# EAGLE design l-drv_h2 (EAGLE 6.5.0)
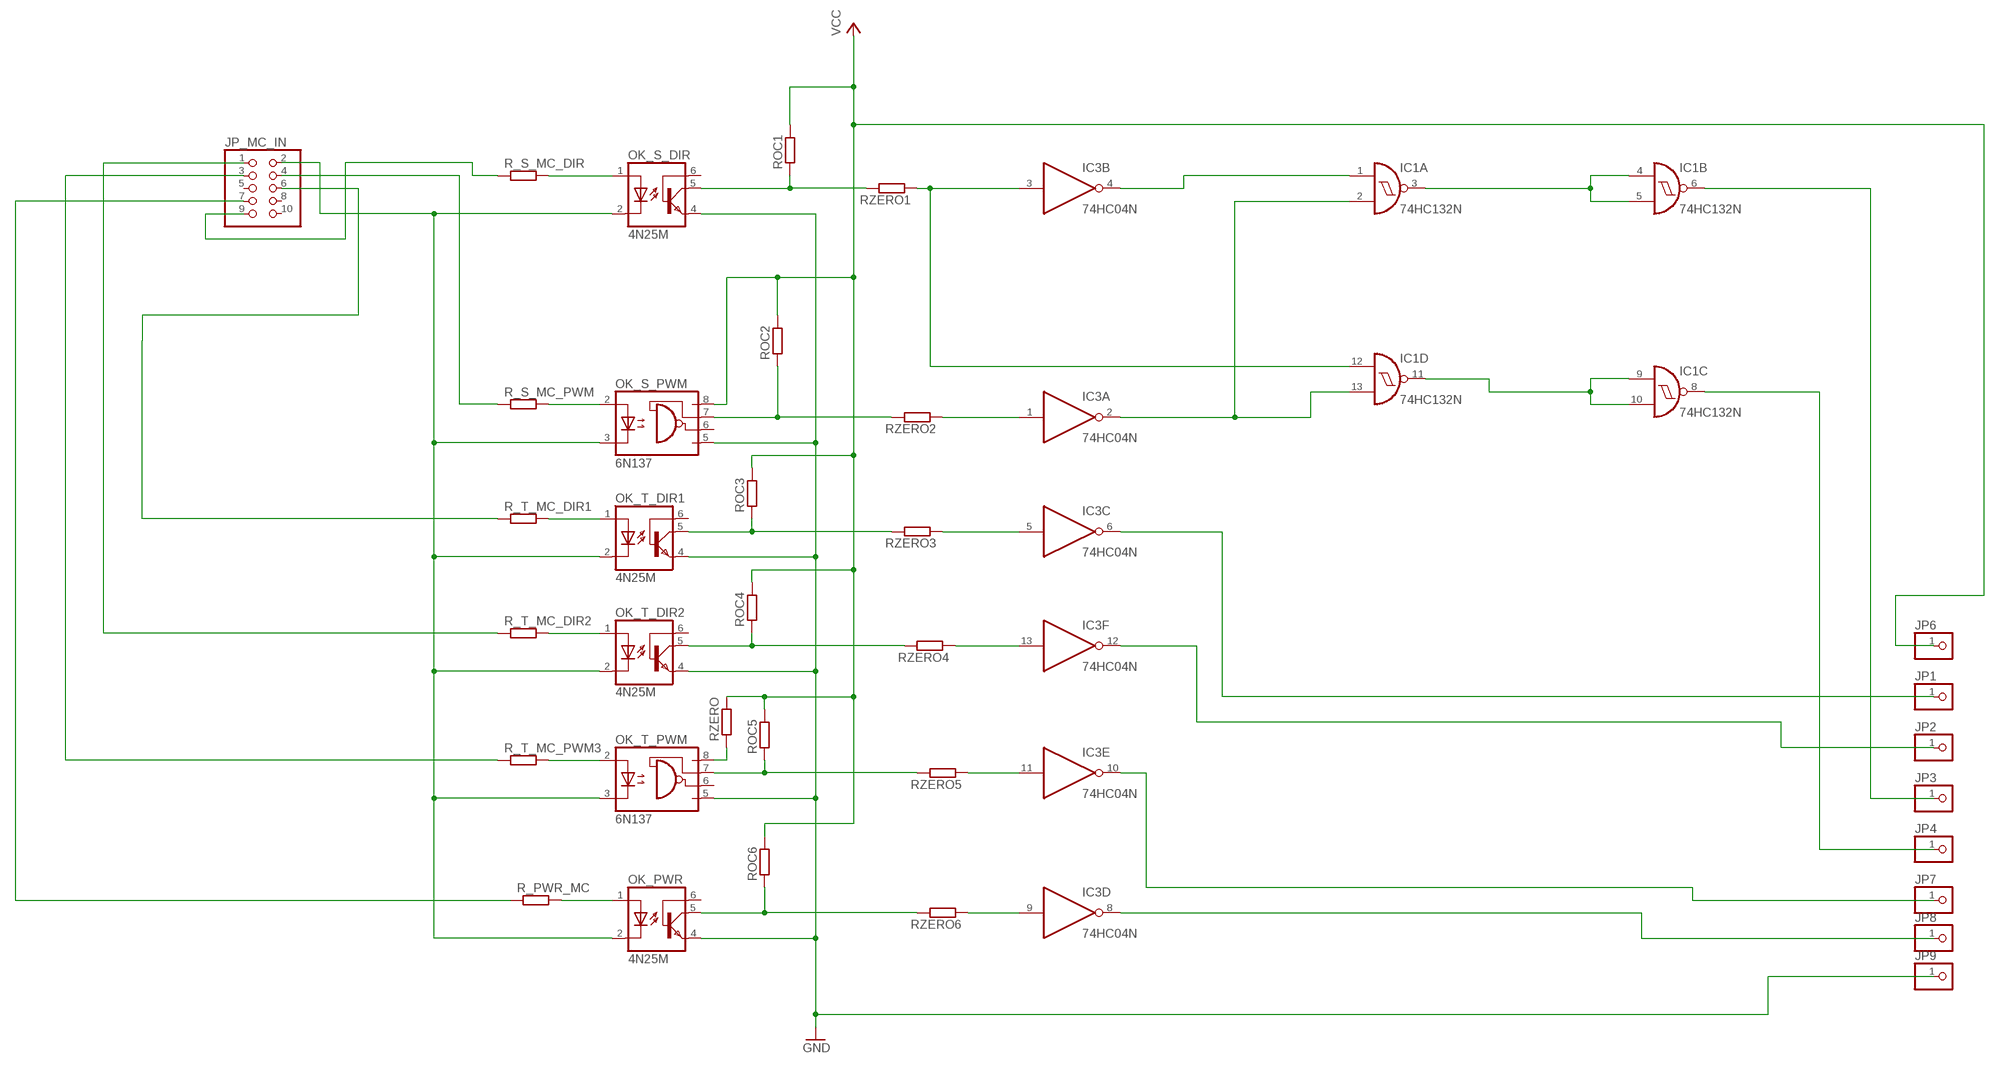
[diagram p0: schematic, sheet 1]

## Parts
IC1  74HC132N  [DIL14]
IC3  74HC04N  [DIL14]
JP1  PINHD-1X1  [1X01]
JP2  PINHD-1X1  [1X01]
JP3  PINHD-1X1  [1X01]
JP4  PINHD-1X1  [1X01]
JP6  PINHD-1X1  [1X01]
JP7  PINHD-1X1  [1X01]
JP8  PINHD-1X1  [1X01]
JP9  PINHD-1X1  [1X01]
JP_MC_IN  PINHD-2X5  [2X05]
OK_PWR  4N25M  [DIL06]
OK_S_DIR  4N25M  [DIL06]
OK_S_PWM  6N137  [DIL08]
OK_T_DIR1  4N25M  [DIL06]
OK_T_DIR2  4N25M  [DIL06]
OK_T_PWM  6N137  [DIL08]
R_PWR_MC  R-EU_0204/5  [0204/5]
R_S_MC_DIR  R-EU_0204/5  [0204/5]
R_S_MC_PWM  R-EU_0204/5  [0204/5]
R_T_MC_DIR1  R-EU_0204/5  [0204/5]
R_T_MC_DIR2  R-EU_0204/5  [0204/5]
R_T_MC_PWM3  R-EU_0204/5  [0204/5]
ROC1  R-EU_0204/5  [0204/5]
ROC2  R-EU_0204/5  [0204/5]
ROC3  R-EU_0204/5  [0204/5]
ROC4  R-EU_0204/5  [0204/5]
ROC5  R-EU_0204/5  [0204/5]
ROC6  R-EU_0204/5  [0204/5]
RZERO  R-EU_0204/5  [0204/5]
RZERO1  R-EU_0204/5  [0204/5]
RZERO2  R-EU_0204/5  [0204/5]
RZERO3  R-EU_0204/5  [0204/5]
RZERO4  R-EU_0204/5  [0204/5]
RZERO5  R-EU_0204/5  [0204/5]
RZERO6  R-EU_0204/5  [0204/5]

## Nets
GND: JP9.1 OK_PWR.4(EMI) OK_S_DIR.4(EMI) OK_S_PWM.5(GND) OK_T_DIR1.4(EMI) OK_T_DIR2.4(EMI) OK_T_PWM.5(GND)
MC_GND: JP_MC_IN.2 OK_PWR.2(C) OK_S_DIR.2(C) OK_S_PWM.3(C) OK_T_DIR1.2(C) OK_T_DIR2.2(C) OK_T_PWM.3(C)
N$1: OK_S_DIR.1(A) R_S_MC_DIR.2
N$2: OK_S_PWM.2(A) R_S_MC_PWM.2
N$3: OK_T_DIR1.1(A) R_T_MC_DIR1.2
N$4: OK_T_DIR2.1(A) R_T_MC_DIR2.2
N$5: OK_T_PWM.2(A) R_T_MC_PWM3.2
N$6: JP_MC_IN.9 R_S_MC_DIR.1
N$7: JP_MC_IN.4 R_S_MC_PWM.1
N$8: JP_MC_IN.6 R_T_MC_DIR1.1
N$9: JP_MC_IN.1 R_T_MC_DIR2.1
N$10: JP_MC_IN.3 R_T_MC_PWM3.1
N$11: OK_T_DIR1.5(COL) ROC3.1 RZERO3.2
N$12: IC1.12(D:I0) IC3.3(B:I) RZERO1.1
N$13: OK_T_PWM.7(VE) ROC5.1 RZERO5.2
N$14: OK_PWR.1(A) R_PWR_MC.2
N$15: OK_T_DIR2.5(COL) ROC4.1 RZERO4.2
N$16: JP_MC_IN.7 R_PWR_MC.1
N$17: OK_S_PWM.7(VE) ROC2.1 RZERO2.2
N$18: OK_S_DIR.5(COL) ROC1.1 RZERO1.2
N$19: OK_PWR.5(COL) ROC6.1 RZERO6.2
N$20: IC3.8(D:O) JP8.1
N$21: IC3.10(E:O) JP7.1
N$22: IC3.12(F:O) JP2.1
N$23: IC3.6(C:O) JP1.1
N$24: IC1.6(B:O) JP3.1
N$25: IC1.8(C:O) JP4.1
N$26: IC1.2(A:I1) IC1.13(D:I1) IC3.2(A:O)
N$27: IC1.1(A:I0) IC3.4(B:O)
N$28: IC1.3(A:O) IC1.4(B:I0) IC1.5(B:I1)
N$29: IC1.9(C:I0) IC1.10(C:I1) IC1.11(D:O)
N$30: IC3.1(A:I) RZERO2.1
N$31: IC3.5(C:I) RZERO3.1
N$32: IC3.13(F:I) RZERO4.1
N$33: IC3.11(E:I) RZERO5.1
N$34: IC3.9(D:I) RZERO6.1
N$35: OK_T_PWM.8(VCC) RZERO.1
VCC: JP6.1 OK_S_PWM.8(VCC) ROC1.2 ROC2.2 ROC3.2 ROC4.2 ROC5.2 ROC6.2 RZERO.2
Unconnected: JP_MC_IN.5 JP_MC_IN.8 JP_MC_IN.10 OK_PWR.6(BAS) OK_S_DIR.6(BAS) OK_S_PWM.6(VO) OK_T_DIR1.6(BAS) OK_T_DIR2.6(BAS) OK_T_PWM.6(VO)

## Power pins joined to a net without a drawn wire
GND: IC1.7(P:GND) IC3.7(P:GND)
VCC: IC1.14(P:VCC) IC3.14(P:VCC)

## Library data of the parts
IC1 = 74xx-eu:74*132: Quad 2-input NAND schmitt trigger
IC3 = 74xx-eu:74*04: Hex INVERTER
JP1-JP4 JP6-JP9 = pinhead:PINHD-1X1: PIN HEADER
JP_MC_IN = pinhead:PINHD-2X5: PIN HEADER
OK_PWR OK_S_DIR OK_T_DIR1 OK_T_DIR2 = optocoupler:4N*?M: General Purpose 6-Pin Phototransistor Optocouplers Source: http://www.fairchildsemi.com/ds/4N/4N35-M.pdf; MPN: 4N25-M; OC_FARNELL: 1021349; OC_NEWARK: 98K9084
OK_S_PWM OK_T_PWM = optocoupler:6N137: MOTOROLA OPTO COUPLER; MPN: 6N137; OC_FARNELL: 1328376; OC_NEWARK: 52M1895
R_PWR_MC R_S_MC_DIR R_S_MC_PWM R_T_MC_DIR1 R_T_MC_DIR2 R_T_MC_PWM3 ROC1-ROC6 RZERO RZERO1-RZERO6 = rcl:R-EU_: RESISTOR, European symbol

## Board
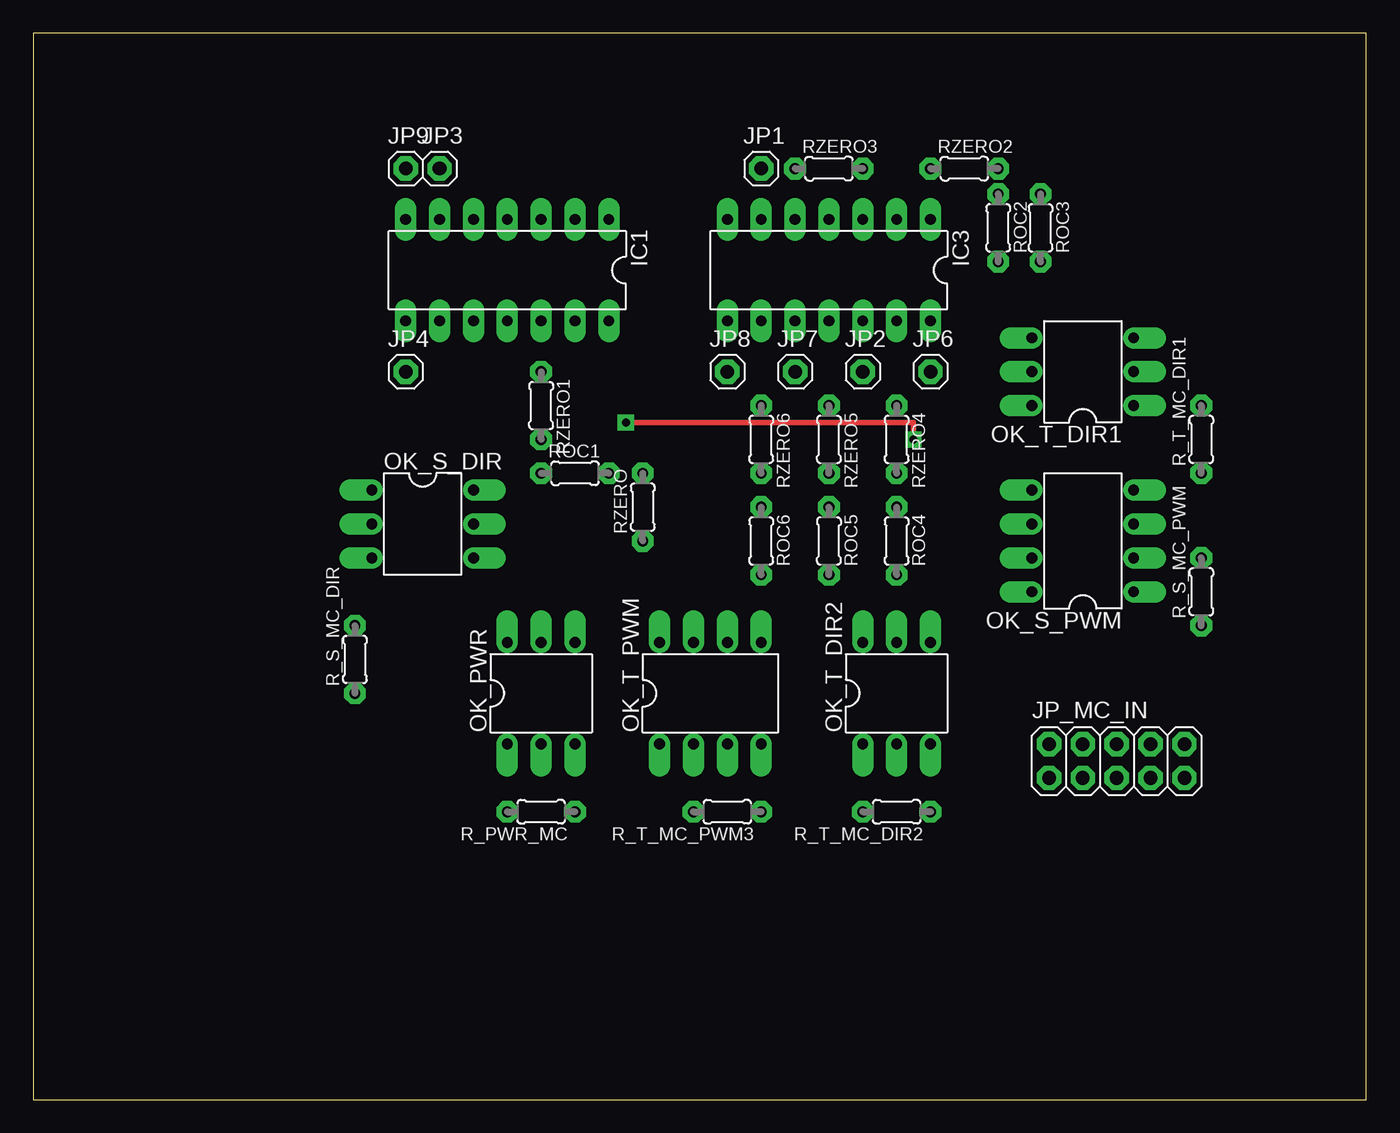
[diagram p1: board, top side]
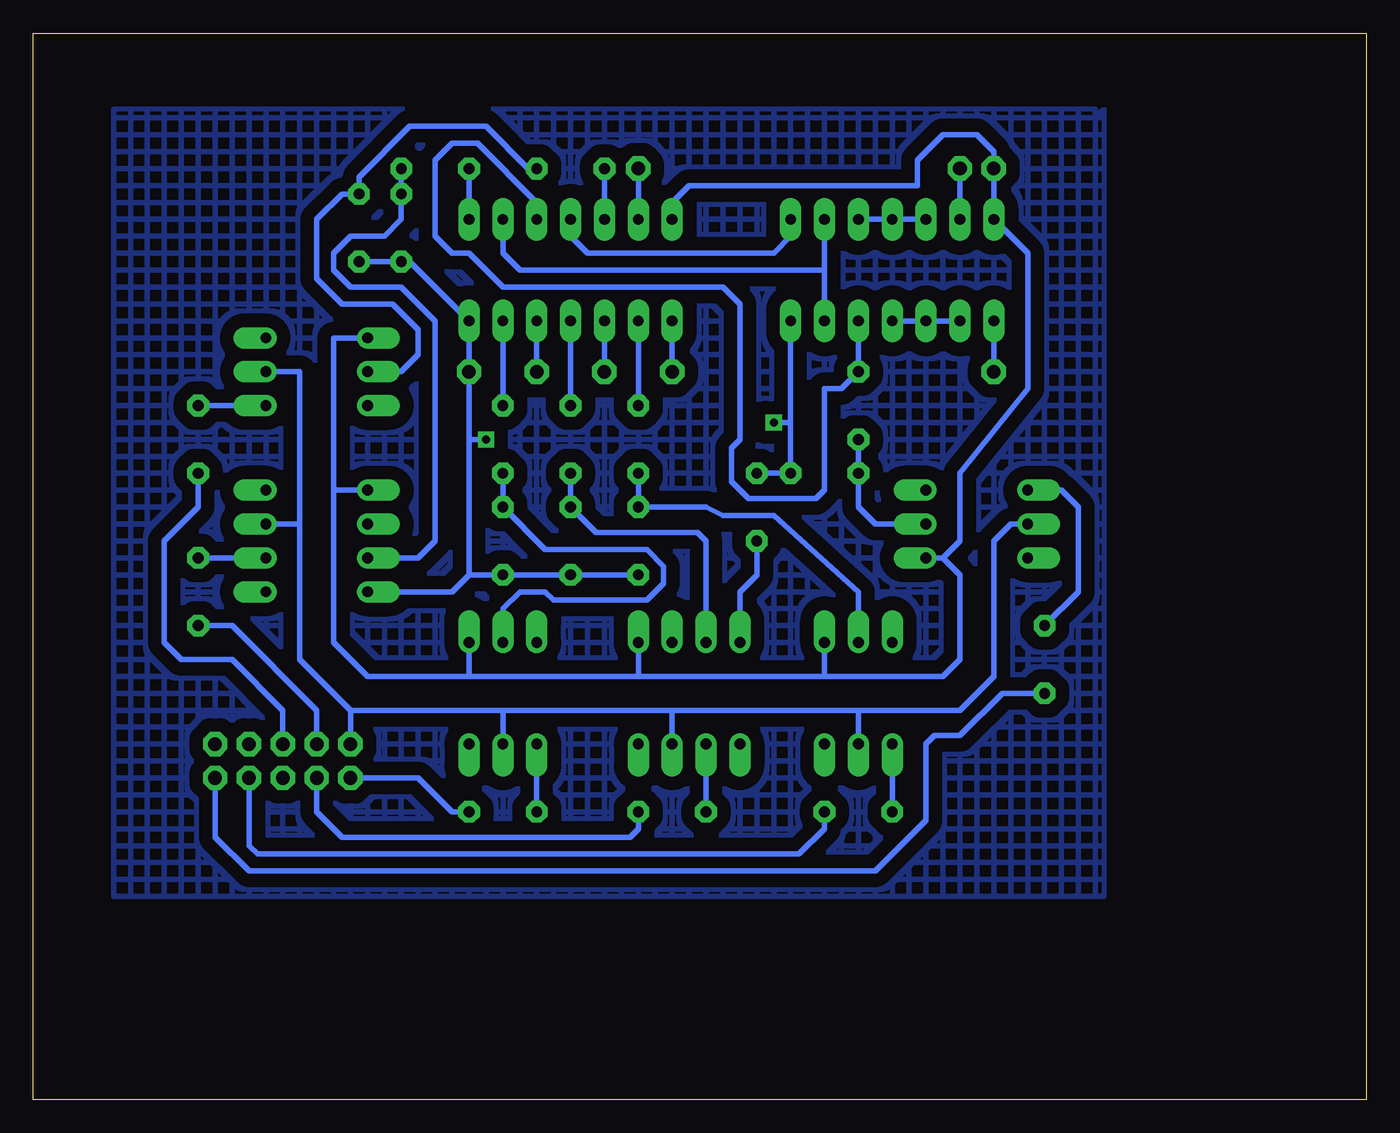
[diagram p2: board, bottom side, seen from below]

Size 100 x 80 mm. Coordinates in mm from the lower left corner, seen from the top.
Outline: 0,0 100,0 100,80 0,80 0,0
Copper layers (1*16): Top 0.035mm / dielectric 1.5mm / Bottom 0.035mm
Design rules "default": minimum track width 10mil, minimum drill 32mil, track to track 40mil, track to pad 40mil, pad to pad 40mil, via to via 40mil, smd to smd 12mil, copper to edge 40mil, drill to drill 40mil, minimum pad ring 16mil, minimum via ring 12mil, stop-mask expansion 4mil, vias tented up to drill 0mil, thermal gap 10mil

### Footprints (pad centres in the part's own frame; a part is rotated, then mirrored left to right if it is on the bottom)
DIL14 = drill 0.813 long: 1 -7.62,-3.81; 2 -5.08,-3.81; 3 -2.54,-3.81; 4 0,-3.81; 5 2.54,-3.81; 6 5.08,-3.81; 7 7.62,-3.81; 8 7.62,3.81; 9 5.08,3.81; 10 2.54,3.81; 11 0,3.81; 12 -2.54,3.81; 13 -5.08,3.81; 14 -7.62,3.81
1X01 = drill 1.016 octagon: 1 0,0
2X05 = drill 1.016 octagon: 1 -5.08,-1.27; 2 -5.08,1.27; 3 -2.54,-1.27; 4 -2.54,1.27; 5 0,-1.27; 6 0,1.27; 7 2.54,-1.27; 8 2.54,1.27; 9 5.08,-1.27; 10 5.08,1.27
DIL06 = drill 0.813 offset: 1 -2.54,-3.81; 2 0,-3.81; 3 2.54,-3.81; 4 2.54,3.81; 5 0,3.81; 6 -2.54,3.81
DIL08 = drill 0.813 offset: 1 -3.81,-3.81; 2 -1.27,-3.81; 3 1.27,-3.81; 4 3.81,-3.81; 5 3.81,3.81; 6 1.27,3.81; 7 -1.27,3.81; 8 -3.81,3.81
0204/5 = drill 0.813 octagon: 1 -2.54,0; 2 2.54,0

### Placement (x,y rotation side)
IC1  35.56,62.23 180 top
IC3  59.69,62.23 180 top
JP1  54.61,69.85 0 top
JP2  62.23,54.61 0 top
JP3  30.48,69.85 0 top
JP4  27.94,54.61 0 top
JP6  67.31,54.61 0 top
JP7  57.15,54.61 0 top
JP8  52.07,54.61 0 top
JP9  27.94,69.85 0 top
JP_MC_IN  81.28,25.4 0 top
OK_PWR  38.1,30.48 0 top
OK_S_DIR  29.21,43.18 270 top
OK_S_PWM  78.74,41.91 90 top
OK_T_DIR1  78.74,54.61 90 top
OK_T_DIR2  64.77,30.48 0 top
OK_T_PWM  50.8,30.48 0 top
R_PWR_MC  38.1,21.59 180 top
R_S_MC_DIR  24.13,33.02 90 top
R_S_MC_PWM  87.63,38.1 90 top
R_T_MC_DIR1  87.63,49.53 90 top
R_T_MC_DIR2  64.77,21.59 180 top
R_T_MC_PWM3  52.07,21.59 180 top
ROC1  40.64,46.99 0 top
ROC2  72.39,65.41 270 top
ROC3  75.56,65.41 270 top
ROC4  64.77,41.91 270 top
ROC5  59.69,41.91 270 top
ROC6  54.61,41.91 270 top
RZERO  45.72,44.45 90 top
RZERO1  38.1,52.07 270 top
RZERO2  69.85,69.85 0 top
RZERO3  59.69,69.85 0 top
RZERO4  64.77,49.53 270 top
RZERO5  59.69,49.53 270 top
RZERO6  54.61,49.53 270 top

### Tracks (layer width: path | path; a pad name or v marks a point on that pad's centre or on a via)
GND
  Bottom 0.406: IC3.7 52.07,67.31 50.8,68.58 33.66,68.58 33.66,70.48 31.75,72.39 29.21,72.39 27.94,71.12 JP9.1 IC1.7 25.4,63.5 25.4,53.34 30.48,46.99 30.48,41.91 31.75,40.64 | OK_T_DIR1.4 77.47,57.15 77.47,45.72 | 73.66,45.72 OK_S_PWM.5 77.47,45.72 | 77.47,45.72 77.47,34.29 74.93,31.75 67.31,31.75 | 67.31,31.75 OK_T_DIR2.4 | OK_T_PWM.5 54.61,31.75 | 54.61,31.75 67.31,31.75 | OK_PWR.4 40.64,31.75 | 40.64,31.75 54.61,31.75 | OK_S_DIR.4 31.75,40.64 | 31.75,40.64 30.48,39.37 30.48,33.02 31.75,31.75 40.64,31.75
MC_GND
  Bottom 0.406: OK_T_DIR2.2 64.77,29.21 | 64.77,29.21 52.07,29.21 | 52.07,29.21 OK_T_PWM.3 | OK_PWR.2 38.1,29.21 | 38.1,29.21 52.07,29.21 | OK_S_DIR.2 26.67,43.18 27.94,41.91 27.94,31.75 30.48,29.21 38.1,29.21 | 64.77,29.21 76.2,29.21 | 76.2,29.21 80.01,33.02 80.01,43.18 | 80.01,43.18 OK_S_PWM.3 83.82,43.18 | OK_T_DIR1.2 80.01,54.61 80.01,43.18 | JP_MC_IN.2 76.2,29.21
N$1
  Bottom 0.406: OK_S_DIR.1 22.86,45.72 21.59,44.45 21.59,38.1 R_S_MC_DIR.2
N$2
  Bottom 0.406: OK_S_PWM.2 R_S_MC_PWM.2
N$3
  Bottom 0.406: OK_T_DIR1.1 R_T_MC_DIR1.2
N$4
  Bottom 0.406: OK_T_DIR2.1 R_T_MC_DIR2.2
N$5
  Bottom 0.406: OK_T_PWM.2 R_T_MC_PWM3.2
N$6
  Bottom 0.406: JP_MC_IN.9 86.36,19.68 83.82,17.14 36.83,17.14 33.02,20.95 33.02,26.67 32.38,27.3 30.48,27.3 27.3,30.48 R_S_MC_DIR.1
N$7
  Bottom 0.406: R_S_MC_PWM.1 85.09,35.56 78.74,29.21 JP_MC_IN.4
N$8
  Bottom 0.406: R_T_MC_DIR1.1 87.63,44.45 90.17,41.91 90.17,34.29 88.9,33.02 85.09,33.02 81.28,29.21 JP_MC_IN.6
N$9
  Bottom 0.406: R_T_MC_DIR2.1 68.58,21.59 71.12,24.13 JP_MC_IN.1
N$10
  Bottom 0.406: R_T_MC_PWM3.1 54.61,20.32 55.24,19.68 76.83,19.68 78.74,21.59 JP_MC_IN.3
N$11
  Bottom 0.406: OK_T_DIR1.5 72.39,54.61 71.12,55.88 71.12,57.78 73.03,59.69 76.83,59.69 78.74,61.59 78.74,66.04 76.83,67.94 ROC3.1 75.56,69.22 71.75,73.03 66.04,73.03 62.87,69.85 RZERO3.2
N$12
  Bottom 0.254: 62.23,67.31 IC3.3
  Bottom 0.406: IC1.12 RZERO1.1 39.37,53.34 40.64,53.34 40.64,45.72 41.27,45.09 46.35,45.09 47.62,46.35 47.62,48.9 46.99,49.53 46.99,59.69 48.26,60.96 64.77,60.96 67.31,63.5 68.58,63.5 69.85,64.77 69.85,70.48 68.58,71.75 66.67,71.75 62.23,67.31
N$13
  Bottom 0.406: RZERO5.2 ROC5.1 57.78,42.55 50.16,42.55 49.53,41.91 OK_T_PWM.7
N$14
  Bottom 0.406: OK_PWR.1 R_PWR_MC.2
N$15
  Bottom 0.406: RZERO4.2 ROC4.1 61.59,41.27 53.98,41.27 52.7,40.01 52.7,38.73 53.98,37.47 60.96,37.47 61.59,38.1 63.5,38.1 64.77,36.83 OK_T_DIR2.5
N$16
  Bottom 0.406: R_PWR_MC.1 40.64,20.32 42.55,18.41 83.19,18.41 83.82,19.05 JP_MC_IN.7
N$17
  Bottom 0.406: RZERO2.2 ROC2.1 72.39,66.04 73.66,64.77 76.2,64.77 77.47,63.5 77.47,62.23 76.2,60.96 72.39,60.96 69.85,58.42 69.85,41.91 71.12,40.64 OK_S_PWM.7
N$18
  Bottom 0.406: RZERO1.2 ROC1.1 38.1,44.45 36.83,43.18 OK_S_DIR.5
N$19
  Bottom 0.406: RZERO6.2 ROC6.1 49.53,44.45 48.26,43.81 44.45,43.81 38.1,38.1 OK_PWR.5
N$20
  Bottom 0.406: IC3.8 JP8.1
N$21
  Bottom 0.406: IC3.10 JP7.1
N$22
  Bottom 0.406: IC3.12 JP2.1
N$23
  Bottom 0.406: JP1.1 IC3.6
N$24
  Bottom 0.406: JP3.1 IC1.6
N$25
  Bottom 0.406: IC1.8 JP4.1
N$26
  Bottom 0.406: 40.64,62.23 63.5,62.23 64.77,63.5 IC3.2 | IC1.13 40.64,62.23 | 40.64,62.23 IC1.2
N$27
  Bottom 0.406: IC1.1 43.18,64.77 44.45,63.5 58.42,63.5 59.69,64.77 IC3.4
N$28
  Bottom 0.406: IC1.3 IC1.4 IC1.5
N$29
  Bottom 0.406: IC1.9 IC1.10 IC1.11
N$30
  Bottom 0.406: RZERO2.1 IC3.1
N$31
  Bottom 0.406: RZERO3.1 IC3.5
N$32
  Bottom 0.406: IC3.13 RZERO4.1
N$33
  Bottom 0.406: IC3.11 RZERO5.1
N$34
  Bottom 0.406: IC3.9 RZERO6.1
N$35
  Bottom 0.406: RZERO.1 45.72,39.37 46.99,38.1 OK_T_PWM.8
N$36
  pour Bottom (hatched): 19.68,74.3 19.68,15.24 92.71,15.24 93.98,15.24 93.98,74.3 20.32,74.3 20.32,73.66
VCC  (via drill 0.6)
  Top 0.406: v44.45,50.8 66.04,50.8 v66.04,49.53
  Bottom 0.406: ROC3.2 ROC2.2 71.75,62.87 IC3.14 JP6.1 67.31,49.53 | 67.31,39.37 ROC4.2 ROC5.2 ROC6.2 | 67.31,39.37 68.58,38.1 OK_S_PWM.8 | 67.31,49.53 67.31,39.37 | IC1.14 43.18,50.8 | 43.18,50.8 ROC1.2 RZERO.2 | 43.18,50.8 v44.45,50.8 | v66.04,49.53 67.31,49.53